# EAGLE design DasAltimeter V0.2 (EAGLE 8.5.0)
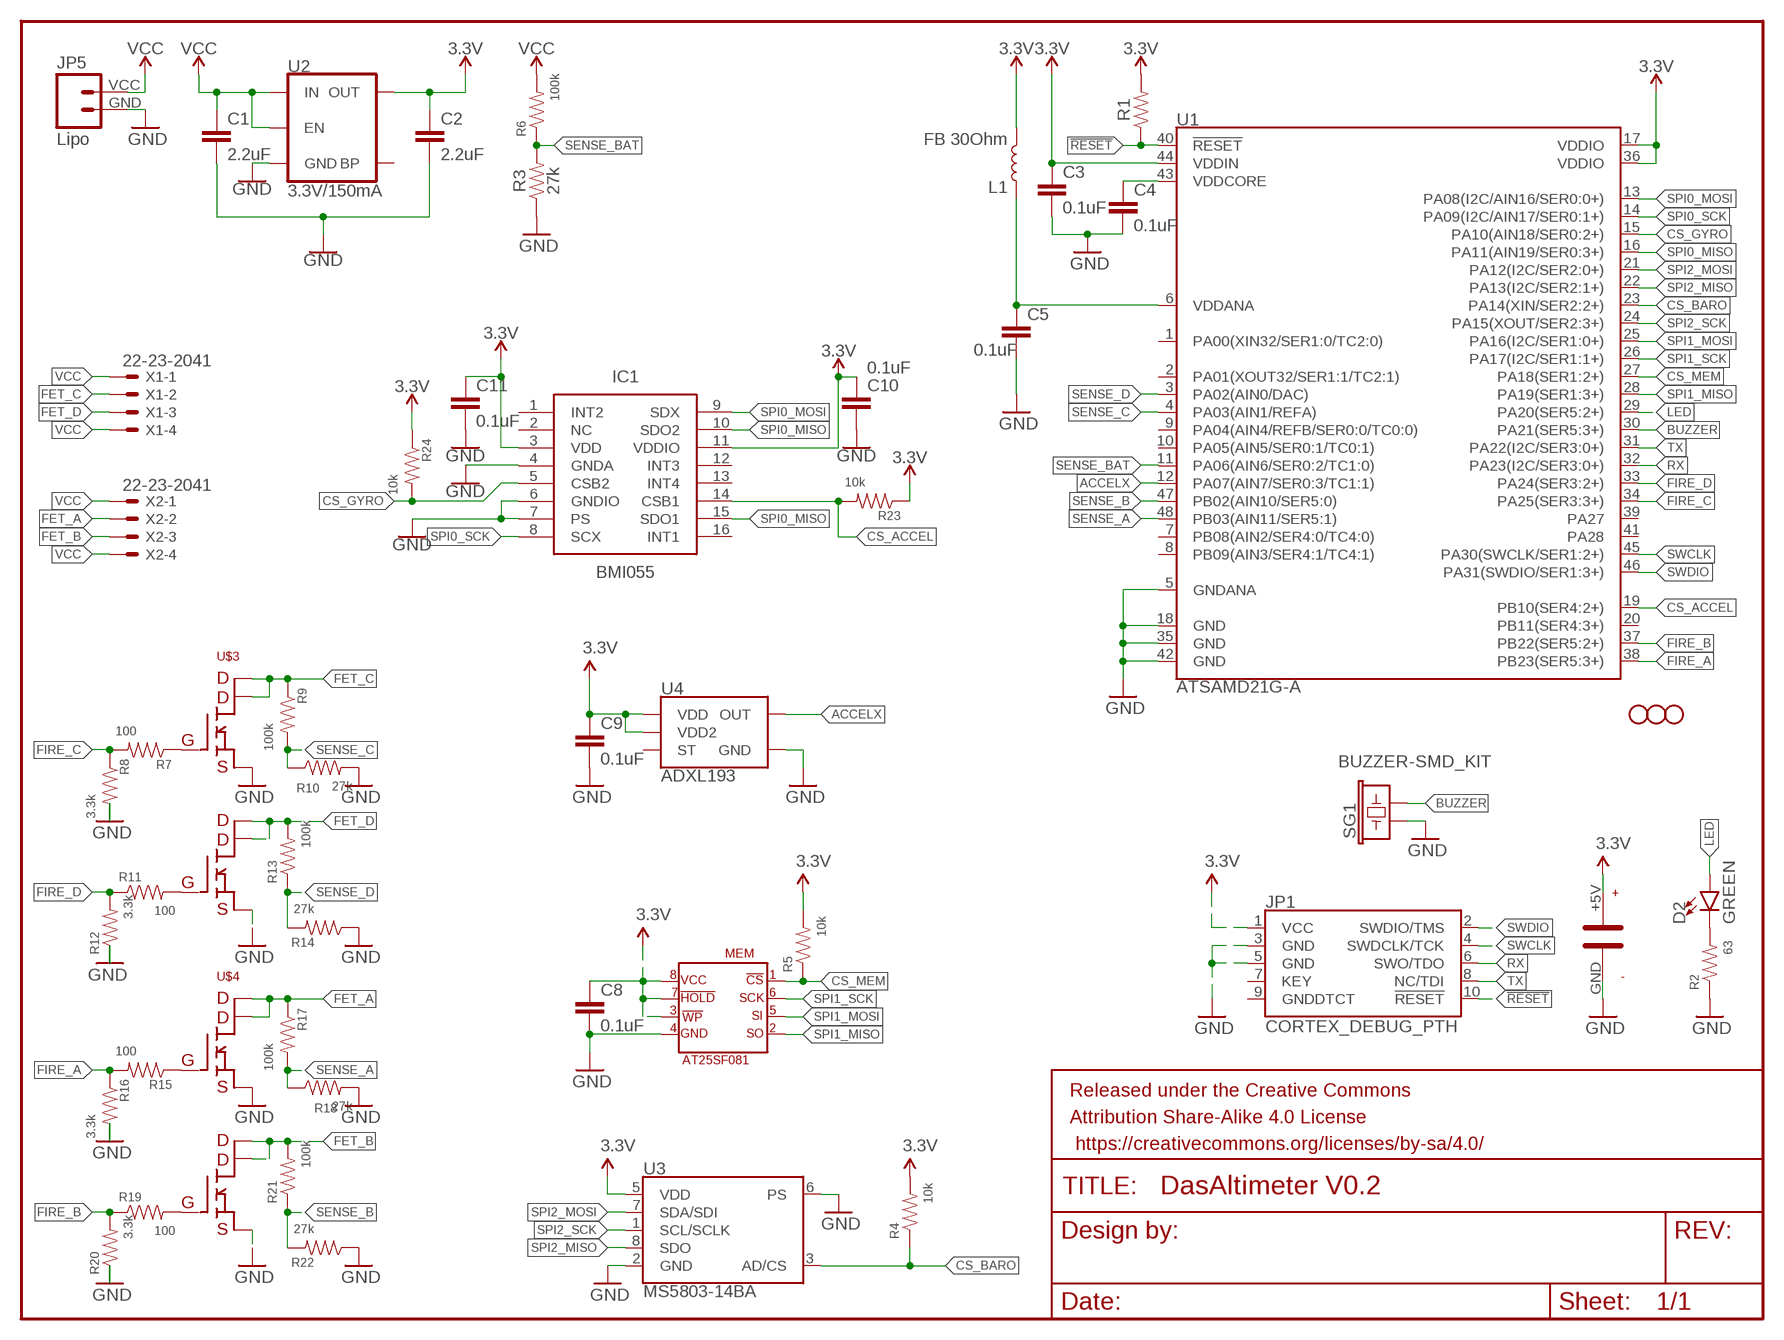
[diagram p0: schematic, sheet 1]

## Parts
C1  2.2uF  2.2UF-0603-10V-20%  [0603]
C2  2.2uF  2.2UF-0603-10V-20%  [0603]
C3  0.1uF  0.1UF-0402-16V-10%  [0402]
C4  0.1uF  0.1UF-0402-16V-10%  [0402]
C5  0.1uF  0.1UF-0402-16V-10%  [0402]
C8  0.1uF  0.1UF-0402-16V-10%  [0402]
C9  0.1uF  0.1UF-0402-16V-10%  [0402]
C10  0.1uF  0.1UF-0402-16V-10%  [0402]
C11  0.1uF  0.1UF-0402-16V-10%  [0402]
D2  GREEN  LED-GREEN1206  [LED-1206]
FRAME1  FRAME-LETTERNO_PACKAGE  [DUMMY]
H1  STAND-OFFTIGHT  [STAND-OFF-TIGHT]
H2  STAND-OFFTIGHT  [STAND-OFF-TIGHT]
H3  STAND-OFFTIGHT  [STAND-OFF-TIGHT]
IC1  BMI055  [BMI055]
JP1  CORTEX_DEBUG_PTH  [2X5-PTH-1.27MM]
JP5  Lipo  M024UCON-15767  [JST-2-SMD-VERT]
L1  FB 30Ohm  INDUCTOR-0603-33NH  [0603]
MEM  AT25SF081  [AT25SF081]
R1  RESISTOR0402  [0402]
R2  63  RESISTOR0402  [0402]
R3  27k  RESISTOR0402  [0402]
R4  10k  RESISTOR0402  [0402]
R5  10k  RESISTOR0402  [0402]
R6  100k  RESISTOR0402  [0402]
R7  100  RESISTOR0402  [0402]
R8  3.3k  RESISTOR0402  [0402]
R9  100k  RESISTOR0402  [0402]
R10  27k  RESISTOR0402  [0402]
R11  100  RESISTOR0402  [0402]
R12  3.3k  RESISTOR0402  [0402]
R13  100k  RESISTOR0402  [0402]
R14  27k  RESISTOR0402  [0402]
R15  100  RESISTOR0402  [0402]
R16  3.3k  RESISTOR0402  [0402]
R17  100k  RESISTOR0402  [0402]
R18  27k  RESISTOR0402  [0402]
R19  100  RESISTOR0402  [0402]
R20  3.3k  RESISTOR0402  [0402]
R21  100k  RESISTOR0402  [0402]
R22  27k  RESISTOR0402  [0402]
R23  10k  RESISTOR0402  [0402]
R24  10k  RESISTOR0402  [0402]
SG1  BUZZER-SMD_KIT  [BUZZER-CCV-KIT]
U1  ATSAMD21G-A  [TQFP-48]
U2  3.3V/150mA  V_REG_MIC52053.3V  [SOT23-5]
U3  MS5803-14BA  [MS5803]
U4  ADXL193  [LCC-8]
U$1  PB-5R0H104-R  [PB-5R0H104-R]
U$3  SI7232DN  [SI7232DN]
U$4  SI7232DN  [SI7232DN]
X1  22-23-2041  [22-23-2041]
X2  22-23-2041  [22-23-2041]

## Nets
3.3V: C2.1 C3.1 C8.1 C9.1 C10.1 C11.1 IC1.3(VDD) IC1.11(VDDIO) JP1.1(VCC) L1.2 MEM.!HOLD MEM.!WP MEM.VCC R1.2 R4.2 R5.2 R23.1 R24.1 U1.17(VDDIO) U1.36(VDDIO) U1.44(VDDIN) U2.5(OUT) U3.5(VDD) U4.P$7(VDD) U4.P$8(VDD2) U$1.+5V
!RESET: JP1.10(!RESET) R1.1 U1.40(!RESET!)
ACCELX: U1.12(PA07(AIN7/SER0:3/TC1:1)) U4.P$6(OUT)
BUZZER: SG1.- U1.30(PA21(SER5:3+))
CS_ACCEL: IC1.14(CSB1) R23.2 U1.19(PB10(SER4:2+))
CS_BARO: R4.1 U1.23(PA14(XIN/SER2:2+)) U3.3(AD/CS)
CS_GYRO: IC1.5(CSB2) R24.2 U1.15(PA10(AIN18/SER0:2+))
CS_MEM: MEM.!CS R5.1 U1.27(PA18(SER1:2+))
FET_A: R17.1 U$4.7(PIN7) U$4.8(PIN8) U$4.9(PIN8) X2.2
FET_B: R21.2 U$4.5(PIN5) U$4.6(PIN6) U$4.10(PIN5) X2.3
FET_C: R9.1 U$3.7(PIN7) U$3.8(PIN8) U$3.9(PIN8) X1.2
FET_D: R13.2 U$3.5(PIN5) U$3.6(PIN6) U$3.10(PIN5) X1.3
FIRE_A: R15.2 R16.1 U1.38(PB23(SER5:3+))
FIRE_B: R19.1 R20.2 U1.37(PB22(SER5:2+))
FIRE_C: R7.2 R8.1 U1.34(PA25(SER3:3+))
FIRE_D: R11.1 R12.2 U1.33(PA24(SER3:2+))
GND: C1.2 C2.2 C3.2 C4.2 C5.2 C8.2 C9.2 C10.2 C11.2 IC1.4(GNDA) IC1.6(GNDIO) IC1.7(PS) JP1.3(GND) JP1.5(GND) JP5.GND MEM.GND R2.1 R3.1 R8.2 R10.2 R12.1 R14.1 R16.2 R18.2 R20.1 R22.1 SG1.+ U1.5(GNDANA) U1.18(GND) U1.35(GND) U1.42(GND) U2.2(GND) U3.2(GND) U3.6(PS) U4.P$3(GND) U$1.GND U$3.1(PIN1) U$3.3(PIN3) U$4.1(PIN1) U$4.3(PIN3)
LED: D2.A U1.29(PA20(SER5:2+))
N$1: R7.1 U$3.2(PIN2)
N$3: C4.1 U1.43(VDDCORE)
N$4: C5.1 L1.1 U1.6(VDDANA)
N$8: R11.2 U$3.4(PIN4)
N$12: R15.1 U$4.2(PIN2)
N$13: R19.2 U$4.4(PIN4)
N$29: D2.C R2.2
RX: JP1.6(SWO/TDO) U1.32(PA23(I2C/SER3:0+))
SENSE_A: R17.2 R18.1 U1.48(PB03(AIN11/SER5:1))
SENSE_B: R21.1 R22.2 U1.47(PB02(AIN10/SER5:0))
SENSE_BAT: R3.2 R6.1 U1.11(PA06(AIN6/SER0:2/TC1:0))
SENSE_C: R9.2 R10.1 U1.4(PA03(AIN1/REFA))
SENSE_D: R13.1 R14.2 U1.3(PA02(AIN0/DAC))
SPI0_MISO: IC1.10(SDO2) IC1.15(SDO1) U1.16(PA11(AIN19/SER0:3+))
SPI0_MOSI: IC1.9(SDX) U1.13(PA08(I2C/AIN16/SER0:0+))
SPI0_SCK: IC1.8(SCX) U1.14(PA09(I2C/AIN17/SER0:1+))
SPI1_MISO: MEM.SO U1.28(PA19(SER1:3+))
SPI1_MOSI: MEM.SI U1.25(PA16(I2C/SER1:0+))
SPI1_SCK: MEM.SCK U1.26(PA17(I2C/SER1:1+))
SPI2_MISO: U1.22(PA13(I2C/SER2:1+)) U3.8(SDO)
SPI2_MOSI: U1.21(PA12(I2C/SER2:0+)) U3.7(SDA/SDI)
SPI2_SCK: U1.24(PA15(XOUT/SER2:3+)) U3.1(SCL/SCLK)
SWCLK: JP1.4(SWDCLK/TCK) U1.45(PA30(SWCLK/SER1:2+))
SWDIO: JP1.2(SWDIO/TMS) U1.46(PA31(SWDIO/SER1:3+))
TX: JP1.8(NC/TDI) U1.31(PA22(I2C/SER3:0+))
VCC: C1.1 JP5.VCC R6.2 U2.1(IN) U2.3(EN) X1.1 X1.4 X2.1 X2.4
Unconnected: IC1.1(INT2) IC1.2(NC) IC1.12(INT3) IC1.13(INT4) IC1.16(INT1) JP1.7(KEY) JP1.9(GNDDTCT) U1.1(PA00(XIN32/SER1:0/TC2:0)) U1.2(PA01(XOUT32/SER1:1/TC2:1)) U1.7(PB08(AIN2/SER4:0/TC4:0)) U1.8(PB09(AIN3/SER4:1/TC4:1)) U1.9(PA04(AIN4/REFB/SER0:0/TC0:0)) U1.10(PA05(AIN5/SER0:1/TC0:1)) U1.20(PB11(SER4:3+)) U1.39(PA27) U1.41(PA28) U2.4(BP) U4.P$4(ST)

## Library data of the parts
C1 C2 = SparkFun-Capacitors:2.2UF: 2.2µF ceramic capacitors A capacitor is a passive two-terminal electrical component used to store electrical energy temporarily in an electric field.; PROD_ID: CAP-07888
C3-C5 C8-C11 = SparkFun-Capacitors:0.1UF: 0.1µF ceramic capacitors A capacitor is a passive two-terminal electrical component used to store electrical energy temporarily in an electric field.; PROD_ID: CAP-12416
D2 = SparkFun-LED:LED-GREEN: Green SMD LED Used in manufacturing of various products at SparkFun Packages: 0603 - SMD 0603 package [Product Link] <http://www.futureelectronics.com/en/technologies/semiconductors/optoelectronics/leds/Pages/9894312-LTST-C190GKT.aspx?CrossPart=HSMG-C190&IM=0> LilyPad 1206 - SMD1206 LilyPad package [Product Link] <http://www.futureelectronics.com/en/Technologies/Product.aspx?ProductID=IN150NGHARVATEKCORPORATION2049943&IM=0> 1206 - SMD1206 package [Product Link] <http://www.futureelectronics.com/en/technologies/semiconductors/optoelectronics/leds/Pages/8315665-LTST-C150KGKT.aspx?IM=0> 1206 Bottom Mount -SMD 1206 Bottom Mount [Product Link] <http://www.digikey.com/product-detail/en/lite-on-inc/LTST-C230KGKT/160-1456-1-ND/386854> SparkFun Products: Pro Mini 328 -5V <https://www.sparkfun.com/products/821> RedBoard <https://www.sparkfun.com/products/12757> MP3 Trigger <https://www.sparkfun.com/products/13720> Makey Makey <https://www.sparkfun.com/products/11076>; PROD_ID: DIO-00862
FRAME1 = SparkFun-Aesthetics:FRAME-LETTER: Schematic Frame - Letter Standard 8.5x11 US Letter frame; DESIGNER: Nobody; VERSION: v01
H1-H3 = SparkFun-Hardware:STAND-OFF: Stand Off Drill holes for mechanically mounting via screws, standoffs, etc. Note: Use the keepout ring to avoid running the screw head into surrounding components. Variant Overviews STAND-OFF - Mechanical footprint for a #4 phillips button head screw. STAND-OFF-TIGHT - Mechanical footprint for a #4 phillips button head screw, Example SparkFun Products Screw - Phillips Head (1/4", 4-40, 10 pack) <https://www.sparkfun.com/products/10453> (PRT-10453) Screw - Phillips Head (1/2", 4-40, 10 pack) <https://www.sparkfun.com/products/10452> (PRT-10452) Screw - Phillips Head (3/4", 4-40, 10 pack) <https://www.sparkfun.com/products/10451> (PRT-10451) Screw - Phillips Head (1", 4-40, 10 pack) <https://www.sparkfun.com/products/10450> (PRT-10450)
IC1 = BMI055:BMI055: IMUs - Inertial Measurement Units 6-Axis Inertia 3x4.5mm LGA-16 <https://componentsearchengine.com/Images/1/BMI055.jpg> Source: Datasheet <https://ae-bst.resource.bosch.com/media/_tech/media/datasheets/BST-BMI055-DS000-08.pdf>; DESCRIPTION: IMUs - Inertial Measurement Units 6-Axis Inertia 3x4.5mm LGA-16; HEIGHT: mm; MANUFACTURER_NAME: Bosch Sensortec; MANUFACTURER_PART_NUMBER: BMI055; SUPPLIER_NAME: RS
JP1 = SparkFun-Connectors:CORTEX_DEBUG: Cortex Debug Connector - 10 pin Supports JTAG debug, Serial Wire debug, and Serial Wire Viewer. PTH and SMD connector options available. General Connector Information <http://infocenter.arm.com/help/topic/com.arm.doc.faqs/attached/13634/cortex_debug_connectors.pdf> Products: PTH Connector <http://www.digikey.com/product-detail/en/cnc-tech/3220-10-0100-00/1175-1627-ND/3883661> -via Digi-Key SparkFun PSoc <https://www.sparkfun.com/products/13229> SparkFun T <https://www.sparkfun.com/products/13810>
JP5 = SparkFun-Connectors:M02: Standard 2-pin 0.1" header. Use with - straight break away headers ( PRT-00116) - right angle break away headers (PRT-00553) - swiss pins (PRT-00743) - machine pins (PRT-00117) - female headers (PRT-00115) Molex polarized connector foot print use with: PRT-08233 with associated crimp pins and housings. 2.54_SCREWTERM for use with PRT-10571. 3.5mm Screw Terminal footprints for PRT-08084 5mm Screw Terminal footprints for use with PRT-08432
L1 = SparkFun-Coils:INDUCTOR: Inductors Resist changes in electrical current. Basically a coil of wire. SparkFun Products: SparkFun Load Cell Amplifier - HX711 <https://www.sparkfun.com/products/13879> IOIO-OTG - V2.2 <https://www.sparkfun.com/products/13613>; PROD_ID: NDUC-07874; VALUE: 33nH/±5%/500mA
MEM = SaL-lib:AT25SF081: AT25SF081 - 8M memory smd
R1-R24 = SparkFun-Resistors:RESISTOR: Generic Resistor Package
SG1 = SparkFun-Electromechanical:BUZZER: Buzzer Small round buzzers that operate around the audible 2kHz range. You can use these as speakers to create simple music or user interfaces. Variant Overview: PTH - Mini Speaker - PC Mount 12mm 2.048kHz <https://www.sparkfun.com/products/7950> PTH_KIT - Mini Speaker - PC Mount 12mm 2.048kHz <https://www.sparkfun.com/products/7950> KIT simplifies soldering by adding stop mask to one side of the pads. PTH_NO_SILK - Mini Speaker - PC Mount 12mm 2.048kHz <https://www.sparkfun.com/products/7950> No silkscreen indicator of buzzer outline. PTH_KIT_NO_SILK - Mini Speaker - PC Mount 12mm 2.048kHz <https://www.sparkfun.com/products/7950> KIT package w/o silkscreen SMD - Buzzer Audio Magnetic (CCV-084B16) SMD buzzer used on, e.g. the LilyPad Buzzer <https://www.sparkfun.com/products/8463> and RFID USB Reader <https://www.sparkfun.com/products/9963>. SMD_KIT - Buzzer Audio Magnetic (CCV-084B16) SMD Buzzer with elongated pins to make soldering easier. Used on the SparkFun Simon Says - Surface Mount Soldering Kit <https://www.sparkfun.com/products/10935>.; PROD_ID: COMP-08568
U1 = SparkFun-IC-Microcontroller:ATSAMD21G: Atmel SAMD21G SMART ARM-Based Microcontroller The Atmel ® | SMART ™ SAM D21 is a series of low-power microcontrollers using the 32-bit ARM ® Cortex ® -M0+ processor, and ranging from 32- to 64-pins with up to 256KB Flash and 32KB of SRAM. The SAM D21 devices operate at a maximum frequency of 48MHz and reach 2.46 CoreMark/MHz. They are designed for simple and intuitive migration with identical peripheral modules, hex compatible code, identical linear address map and pin compatible migration paths between all devices in the product series. All devices include intelligent and flexible peripherals, Atmel Event System for inter-peripheral signaling, and support for capacitive touch button, slider and wheel user interfaces. Datasheet <https://cdn.sparkfun.com/datasheets/Dev/Arduino/Boards/Atmel-42181-SAM-D21_Datasheet.pdf> SparkFun Products SparkFun SAMD21 Mini Breakout <https://www.sparkfun.com/products/13664> (DEV-13664) SparkFun SAMD21 Dev Breakout <https://www.sparkfun.com/products/13672> (DEV-13672); PROD_ID: IC-13064
U2 = SparkFun-IC-Power:V_REG_MIC5205: V_REG MIC5205 Standard 3.3V, 5V, and Adjustable 150mA LDO voltage regulator in SOT-23 layout. Micrel part MIC5205. BP (by-pass) pin is used to lower output noise with 470pF cap, may be left open. On the adjustable version BP is used to set output.; PROD_ID: VREG-00822
U3 = SparkFun-Sensors:MS5803-14BA: Measurement Specialties MS5803_14BA Pressure (Depth) Sensor The MS5803-14BA is a new generation of high resolution pressure sensors with SPI and I2C bus interface. It is optimized for depth measurement systems with a water depth resolution of 1cm and below. The sensor module includes a high linear pressure sensor and an ultra low power 24 bit ΔΣ ADC with internal factory calibrated coefficients. It provides a precise digital 24 Bit pressure and temperature value and different operation modes that allow the user to optimize for conversion speed and current consumption. Datasheet <https://cdn.sparkfun.com/datasheets/Sensors/Weather/ms5803_14ba.pdf> SparkFun Products SparkFun Pressure Sensor Breakout - MS5803-14BA <https://www.sparkfun.com/products/12909> (SEN-12909); PROD_ID: IC-12111
U4 = SparkFun-Sensors:ADXL193: Analog Devices ADXL193 - 250g Accelerometer w/ Analog Output The ADXL193 is a small (5 mm x 5 mm x 2 mm ceramic LCC package), low power (1.5 mA current at 5V), single axis high-g iMEMS® accelerometer designed to sense shock and vibration at g-ranges of ±120g or ±250g. Three models are available and include AD22282-A-R2 (±120g) and AD22283-B-R2 (±250g). These products are used in a variety of crash/impact detection applications which include automotive airbag crash detection systems as well as medical, industrial, and sports equipment. Datasheet <https://www.sparkfun.com/datasheets/Sensors/Accelerometer/ADXL193.pdf> SparkFun Products SparkFun Single Axis Accelerometer Breakout - ADXL193 (+/-250g) <https://www.sparkfun.com/products/9332> (SEN-09332); PROD_ID: IC-09219
U$1 = SaL-lib1:PB-5R0H104-R
U$3 U$4 = SaL-lib1:SI7232DN: SI7232DN dual
X1 X2 = con-molex:22-23-2041: .100" (2.54mm) Center Header - 4 Pin; MF: MOLEX; MPN: 22-23-2041; OC_FARNELL: 1462920; OC_NEWARK: 38C0355

## Board
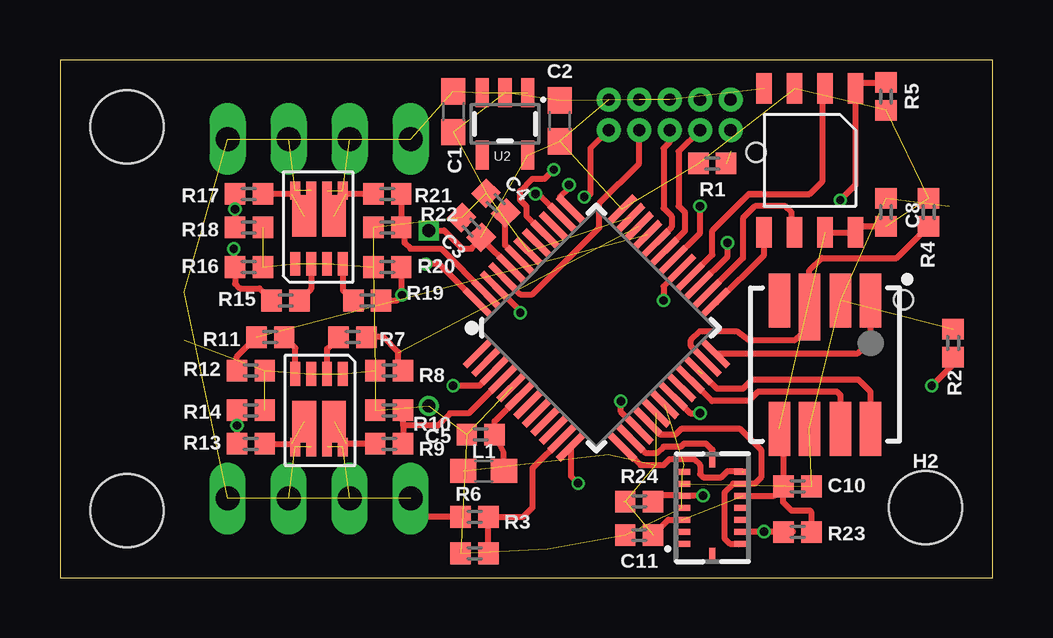
[diagram p1: board, top side]
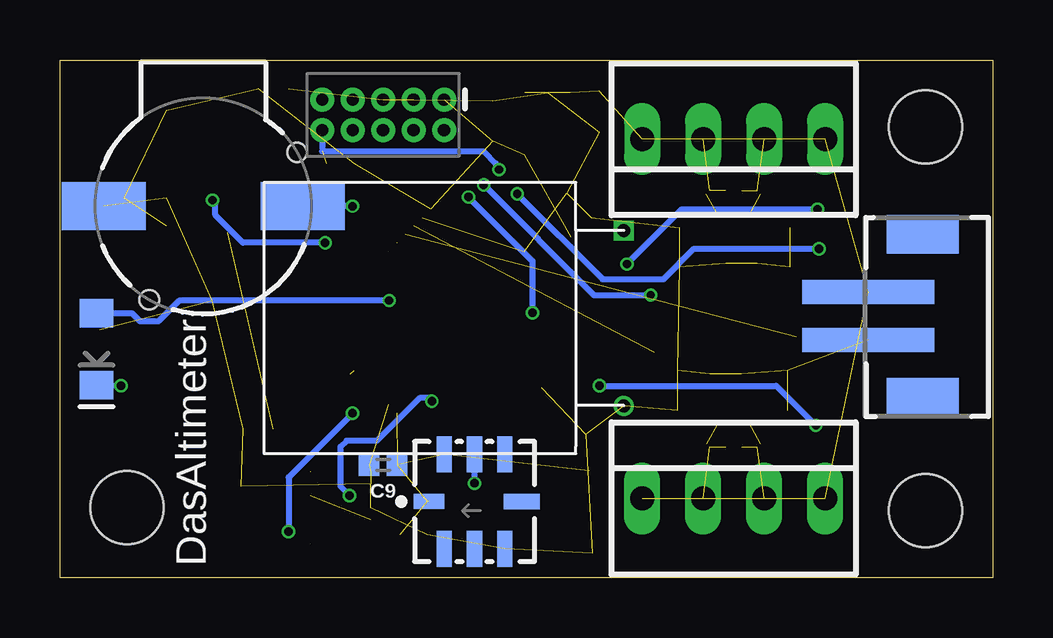
[diagram p2: board, bottom side, seen from below]

Size 38.86 x 21.59 mm. Coordinates in mm from the lower left corner, seen from the top.
Outline: 0,0 38.86,0 38.86,21.59 0,21.59 0,0
Copper layers (1*2*15*16): Top 0.035559375mm / dielectric 0.17018125mm / Route2 0.01778125mm / dielectric 47mil / Route15 0.01778125mm / dielectric 0.17018125mm / Bottom 0.035559375mm
Design rules "oshpark-4layer-tented *": minimum track width 5mil, minimum drill 10mil, track to track 10mil, track to pad 5mil, pad to pad 5mil, via to via 5mil, smd to smd 5mil, copper to edge 15mil, drill to drill 6mil, minimum pad ring 4mil, minimum via ring 4mil, stop-mask expansion 2.5mil, vias tented up to drill 20mil, thermal gap 10mil

### Footprints (pad centres in the part's own frame; a part is rotated, then mirrored left to right if it is on the bottom)
0603 = smd 1.1 x 1: 1 -0.85,0; 2 0.85,0
0402 = smd 0.85 x 0.9: 1 -0.58,0; 2 0.58,0
LED-1206 = smd 1.2 x 1.4: A -1.5,0; C 1.5,0
STAND-OFF-TIGHT = hole 3.048: 0,0
BMI055 = smd 0.675 x 0.25: 1 1.262,1.5; 2 1.262,1; 3 1.262,0.5; 4 1.262,0; 5 1.262,-0.5; 6 1.262,-1; 7 1.262,-1.5; 9 -1.262,-1.5; 10 -1.262,-1; 11 -1.262,-0.5; 12 -1.262,0; 13 -1.262,0.5; 14 -1.262,1; 15 -1.262,1.5 | smd 0.25 x 0.675: 8 0,-2.013; 16 0,2.013
2X5-PTH-1.27MM = drill 0.508 pad 1: 1 -2.54,-0.635; 2 -2.54,0.635; 3 -1.27,-0.635; 4 -1.27,0.635; 5 0,-0.635; 6 0,0.635; 7 1.27,-0.635; 8 1.27,0.635; 9 2.54,-0.635; 10 2.54,0.635
JST-2-SMD-VERT = smd 1 x 5.5: GND 1,-2; VCC -1,-2 | smd 1.6 x 3: P$1 -3.4,0.27; P$2 3.4,0.27
AT25SF081 = smd 1.27 x 0.635: !CS -3,2.54; !HOLD 3,1.27; !WP -3,0; GND -3,-1.27; SCK 3,0; SI 3,-1.27; SO -3,1.27; VCC 3,2.54
BUZZER-CCV-KIT = smd 3.5 x 2: + 4.15,0; - -4.15,0 | hole 0.8: -3.9,-2.25; 2.25,3.9
TQFP-48 = smd 1.5 x 0.28: 1 -4.25,2.75; 2 -4.25,2.25; 3 -4.25,1.75; 4 -4.25,1.25; 5 -4.25,0.75; 6 -4.25,0.25; 7 -4.25,-0.25; 8 -4.25,-0.75; 9 -4.25,-1.25; 10 -4.25,-1.75; 11 -4.25,-2.25; 12 -4.25,-2.75; 25 4.25,-2.75; 26 4.25,-2.25; 27 4.25,-1.75; 28 4.25,-1.25; 29 4.25,-0.75; 30 4.25,-0.25; 31 4.25,0.25; 32 4.25,0.75; 33 4.25,1.25; 34 4.25,1.75; 35 4.25,2.25; 36 4.25,2.75 | smd 0.28 x 1.5: 13 -2.75,-4.25; 14 -2.25,-4.25; 15 -1.75,-4.25; 16 -1.25,-4.25; 17 -0.75,-4.25; 18 -0.25,-4.25; 19 0.25,-4.25; 20 0.75,-4.25; 21 1.25,-4.25; 22 1.75,-4.25; 23 2.25,-4.25; 24 2.75,-4.25; 37 2.75,4.25; 38 2.25,4.25; 39 1.75,4.25; 40 1.25,4.25; 41 0.75,4.25; 42 0.25,4.25; 43 -0.25,4.25; 44 -0.75,4.25; 45 -1.25,4.25; 46 -1.75,4.25; 47 -2.25,4.25; 48 -2.75,4.25
SOT23-5 = smd 0.55 x 1.2: 1 -0.95,-1.3; 2 0,-1.3; 3 0.95,-1.3; 4 0.95,1.3; 5 -0.95,1.3
MS5803 = smd 2.25 x 0.9: 1 -2.675,1.9; 2 -2.675,0.65; 4 -2.675,-1.9; 5 2.675,-1.9; 6 2.675,-0.65; 7 2.675,0.65; 8 2.675,1.9 | smd 2.8 x 0.9: 3 -2.4,-0.65
LCC-8 = smd 1.5 x 0.64: P$1 -1.96,1.26; P$2 -1.96,0; P$3 -1.96,-1.26; P$5 1.96,-1.26; P$6 1.96,0; P$7 1.96,1.26 | smd 0.64 x 1.5: P$4 0,-1.96 | smd 0.64 x 1.27: P$8 0.01,1.9
PB-5R0H104-R = drill 0.55 square: +5V 0,0 | drill 0.55: GND 0,7.32
SI7232DN = smd 0.991 x 0.406: 1 -1.13,0.991; 2 -1.13,0.33; 3 -1.13,-0.33; 4 -1.13,-0.991 | smd 0.762 x 0.406: 5 1.918,-0.991; 6 1.918,-0.33; 7 1.918,0.33; 8 1.918,0.991 | smd 1.727 x 0.991: 9 0.864,0.622; 10 0.864,-0.622
22-23-2041 = drill 1 long: 1 -3.81,0; 2 -1.27,0; 3 1.27,0; 4 3.81,0

### Placement (x,y rotation side)
C1  16.38,19.43 270 top
C2  20.83,19.05 90 top
C3  17.14,14.61 135 top
C4  18.16,15.62 135 top
C5  17.53,5.97 180 top
C8  34.42,15.24 90 top
C9  25.4,4.7 180 bottom
C10  30.73,3.81 0 top
C11  24.13,1.78 180 top
D2  37.34,9.53 270 bottom
FRAME1  -24.13,48.26 0 top  (outside the outline)
H1  2.79,18.8 0 top
H2  36.07,2.92 0 top
H3  2.79,2.79 0 top
IC1  27.18,2.92 180 top
JP1  25.4,19.3 180 bottom
JP5  3.17,10.92 270 bottom
L1  17.65,4.45 180 top
MEM  30.61,17.4 270 top
R1  27.18,17.27 180 top
R2  37.21,9.78 270 top
R3  17.27,1.02 0 top
R4  36.2,15.24 90 top
R5  34.42,20.07 270 top
R6  17.27,2.54 180 top
R7  12.19,10.03 0 top
R8  13.72,8.64 180 top
R9  13.72,5.59 0 top
R10  13.72,6.99 180 top
R11  8.76,10.03 0 top
R12  7.95,8.64 180 top
R13  7.95,5.59 0 top
R14  7.95,6.99 180 top
R15  9.4,11.56 180 top
R16  7.87,12.95 0 top
R17  7.87,16 180 top
R18  7.87,14.61 0 top
R19  12.8,11.56 180 top
R20  13.64,12.95 0 top
R21  13.64,16 180 top
R22  13.64,14.61 0 top
R23  30.73,1.91 180 top
R24  24.13,3.17 0 top
SG1  32.89,15.49 180 bottom
U1  22.35,10.41 45 top
U2  18.54,18.92 180 top
U3  31.88,8.89 270 top
U4  21.59,3.17 90 bottom
U$1  15.37,14.48 180 bottom
U$3  10.79,7.37 270 top
U$4  10.79,14.22 90 top
X1  10.79,3.3 0 bottom
X2  10.79,18.29 180 bottom

### Tracks (layer width: path | path; a pad name or v marks a point on that pad's centre or on a via)
3.3V  (17 unrouted)
  Top 0.254: C8.1 33.41,14.66 MEM.VCC MEM.!HOLD | C11.1 25.35,2.42 IC1.3 | IC1.11 29.77,3.42 30.13,3.78 | 30.13,3.78 C10.1 30.15,6.04 U3.5 | R23.1 31.31,2.72 31.24,2.79 30.48,2.79 30.13,3.15 30.13,3.78 | 17.55,14.15 U1.44 | 17.55,14.15 C3.1 | U$1.+5V 16,14.48 16.76,13.72 17.14,13.72 17.55,14.13 17.55,14.15
!RESET  (via drill 0.35)  (1 unrouted)
  Top 0.254: v20.57,17.02 20.19,16.64 19.68,16.64 19.18,16.13 19.18,15.75 19.44,15.48 19.44,15.09 U1.40
  Bottom 0.254: JP1.10 27.94,17.78 21.21,17.78 20.7,17.27 20.7,17.14 v20.57,17.02
ACCELX  (via drill 0.35)
  Top 0.254: U1.12 21.29,4.24 v21.59,3.94
  Bottom 0.254: v21.59,3.94 U4.P$6
BUZZER  (via drill 0.35)
  Top 0.254: U1.30 26.67,14.38 26.67,14.69 | 26.67,14.69 | 26.67,14.69 v26.67,15.49
  Bottom 0.254: v26.67,15.49 SG1.-
CS_ACCEL  (via drill 0.35)
  Top 0.254: R23.2 30.55,1.92 v29.34,1.92 IC1.14 | U1.19 26.26,6.86 v26.67,6.86
  Bottom 0.254: v26.67,6.86 29.34,4.19 v29.34,1.92
CS_BARO
  Top 0.254: U1.23 26.29,9.66 26.29,9.91 26.67,10.29 28.19,10.29 28.7,9.91 30.61,9.91 31.23,10.4 U3.3 31.23,12.81 31.75,13.34 34.87,13.34 R4.1
CS_GYRO  (via drill 0.35)
  Top 0.254: U1.15 23.37,6.92 v23.37,7.37 | v26.8,3.43 26.42,3.42 IC1.5 25.91,3.43 25.09,3.43 R24.2
  Bottom 0.254: v23.37,7.37 23.5,7.49 23.88,7.49 25.65,5.71 26.92,5.71 27.18,5.46 27.18,3.81 v26.8,3.43
CS_MEM  (via drill 0.35)
  Top 0.254: R5.1 33.39,20.65 MEM.!CS 33.15,16.38 v32.51,15.75 | U1.27 27.81,13.4 v27.81,13.97
  Bottom 0.254: v27.81,13.97 31.24,13.97 32.38,15.11 32.38,15.75 v32.51,15.75
FET_A  (3 unrouted)
  Top 0.254: U$4.8 9.66,16 R17.1
FET_B  (3 unrouted)
  Top 0.254: R21.2 11.93,16 U$4.5
FET_C  (3 unrouted)
  Top 0.254: R9.1 11.93,5.59 U$3.8
FET_D  (3 unrouted)
  Top 0.254: R13.2 9.66,5.59 U$3.5
FIRE_A  (via drill 0.35)
  Top 0.254: R15.2 8.31,12.06 7.49,12.06 7.29,12.26 R16.1 7.24,12.95 v7.24,13.72 | U1.38 19.95,16 v19.81,16
  Bottom 0.254: v19.81,16 16.26,12.45 13.72,12.45 12.45,13.72 v7.24,13.72
FIRE_B  (via drill 0.35)
  Top 0.254: U1.37 21.29,15.41 20.83,15.88 21.21,16.26 v21.21,16.38 | R19.1 14.02,11.56 v14.25,11.79 14.22,11.81 R20.2
  Bottom 0.254: v21.21,16.38 16.61,11.79 v14.25,11.79
FIRE_C  (1 unrouted)
  Top 0.254: R8.1 14.1,8.84 14.1,9.4 13.46,10.03 R7.2
FIRE_D  (1 unrouted)
  Top 0.254: R12.2 7.37,9.22 R11.1
GND  (39 unrouted)
LED  (via drill 0.35)
  Top 0.254: U1.29 25.15,12.15 v25.15,11.56
  Bottom 0.254: v25.15,11.56 33.9,11.56 34.77,10.69 35.52,10.69 35.86,11.03 D2.A
N$1
  Top 0.254: U$3.2 11.12,9.55 R7.1
N$3
  Top 0.254: U1.43 18.54,13.87 18.54,15.18 C4.1
N$4
  Top 0.254: U1.6 18.11,6.52 C5.1 18.49,5.22 L1.1
N$8
  Top 0.254: U$3.4 9.8,9.57 R11.2
N$12
  Top 0.254: U$4.2 10.46,12.04 R15.1
N$13
  Top 0.254: U$4.4 11.79,11.99 R19.2
N$29  (via drill 0.35)
  Top 0.254: R2.2 37.21,8.89 v36.32,8
  Bottom 0.254: v36.32,8 37.31,8 D2.C
RX  (1 unrouted)
  Top 0.254: JP1.6 25.4,18.16 25.15,17.91 25.15,15.41 25.48,15.07 25.48,14.63 24.96,14.11 24.82,13.96 | 24.82,13.96
SENSE_A  (via drill 0.35)
  Top 0.254: R17.2 v7.29,15.37 R18.1 | U1.48 15.8,13.08 v15.24,13.08
  Bottom 0.254: v15.24,13.08 12.95,15.37 v7.29,15.37
SENSE_B
  Top 0.254: R21.1 R22.2 14.35,14.47 14.35,13.97 14.61,13.72 15.88,13.72 U1.47
SENSE_BAT
  Top 0.254: U1.11 19.68,4.57 19.68,2.92 19.3,2.54 R6.1 R3.2
SENSE_C
  Top 0.254: 14.3,6.35 R10.1 | 14.3,6.35 R9.2 | U1.4 17.03,6.86 16.26,6.86 15.75,6.35 14.3,6.35
SENSE_D  (via drill 0.35)
  Top 0.254: R14.2 v7.37,6.35 R13.1 | U1.3 17.46,8 v16.38,8
  Bottom 0.254: v16.38,8 9.02,8 v7.37,6.35
SPI0_MISO  (1 unrouted)
  Top 0.254: U1.16 25.02,5.98 25.02,5.97 25.65,5.97 25.91,6.22 28.32,6.22 29.21,5.33 29.21,4.19 28.94,3.92 IC1.10 28.05,3.92 27.69,3.56 27.69,1.65 27.92,1.42 28.24,1.42 28.26,1.4 IC1.15
SPI0_MOSI  (1 unrouted)
  Top 0.254: U1.13 24.18,4.7 25.15,4.7 25.4,4.95 26.42,4.95 26.67,4.7 26.67,4.32 26.8,4.19 27.56,4.19 27.81,4.45 28.42,4.45 IC1.9
SPI0_SCK
  Top 0.254: U1.14 24.38,5.21 24.89,5.21 25.15,5.46 25.86,5.46 25.99,5.59 26.92,5.59 27.18,5.33 IC1.8
SPI1_MISO
  Top 0.254: MEM.SO 31.75,20.27 31.75,16.51 31.24,16 29.21,16 | 29.21,16 28.75,16 | U1.28 27.18,13.47 27.18,14.48 28.7,16 29.21,16
SPI1_MOSI
  Top 0.254: U1.25 27.35,11.47 29.34,13.46 MEM.SI
SPI1_SCK
  Top 0.254: MEM.SCK 30.48,14.53 30.48,15.24 30.23,15.49 28.96,15.49 28.45,14.99 28.45,13.33 U1.26
SPI2_MISO  (1 unrouted)
  Top 0.254: U3.8 33.78,7.75 33.27,8.26 28.83,8.26 28.45,7.87 27.94,7.87 | 27.94,7.87 27.69,7.87 | 27.94,7.87 27.38,7.87 26.76,8.49
SPI2_MOSI
  Top 0.254: U3.7 32.53,7.61 32.38,7.75 29.08,7.75 28.7,7.37 27.17,7.37 U1.21
SPI2_SCK
  Top 0.254: U1.24 33.23,9.35 33.78,9.9 U3.1
SWCLK
  Top 0.254: U1.45 19.19,11.81 19.68,11.81 22.48,14.61 22.48,15.62 24.13,17.27 JP1.4
SWDIO  (via drill 0.35)
  Top 0.254: JP1.2 22.1,17.91 22.1,16 21.97,15.88 v21.84,15.88 | U1.46 19.18,11.11 v19.18,11.05
  Bottom 0.254: v21.84,15.88 19.18,13.21 v19.18,11.05
TX  (1 unrouted)
  Top 0.254: U1.31 26.04,14.46 26.04,15.24 25.78,15.49 25.78,17.78 JP1.8 | U1.31
VCC  (7 unrouted)
  Top 0.254: R6.2 14.73,2.54 14.61,2.67 X1.1

### Text on the board
bNames: DasAltimeter